# EAGLE design step_up_actuator (EAGLE 6.6.0)
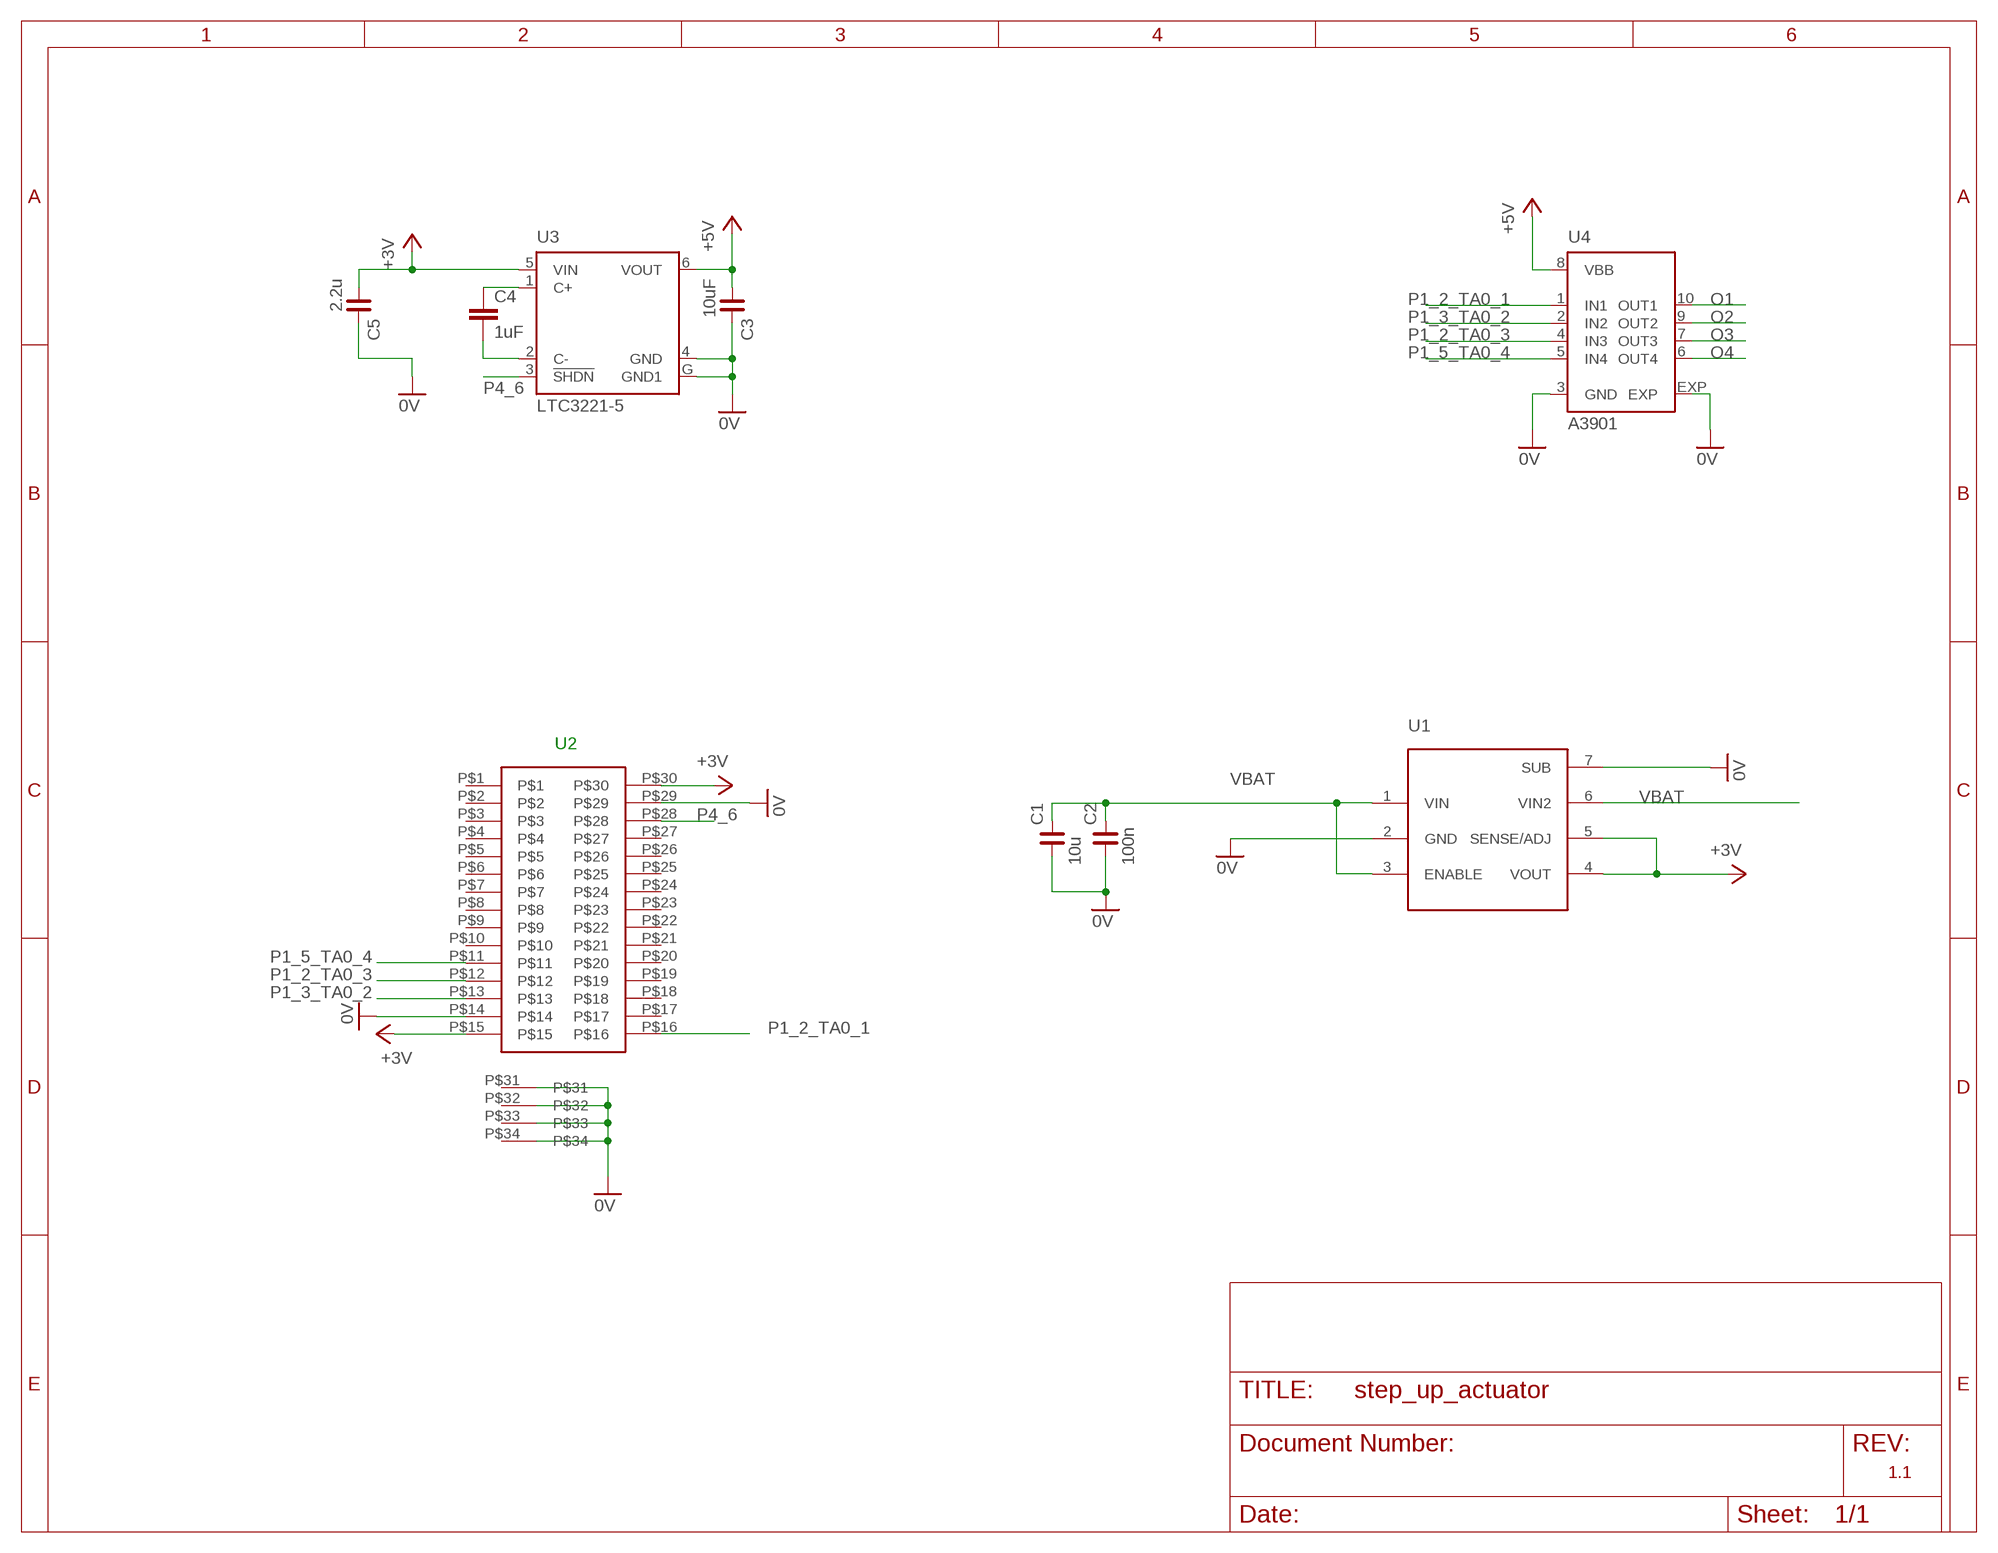
[diagram p0: schematic, sheet 1]

## Parts
C1  10u  C_0402  [C0402]
C2  100n  C_0402  [C0402]
C3  10uF  C_1206  [C1206]
C4  1uF  C-EUC0402  [C0402]
C5  2.2u  C_0402  [C0402]
U3  LTC3221-5  [DFN6-2X2]
U4  A3901  [DFN10-3X3]
U$1  NCP606  [NCP606]
U$3  51338-0374_RECEPTACLE  [51338-0374_RECEPTACLE]

## Nets
0V: C1.1 C2.1 C3.2 C5.2 U3.4(GND) U3.G(GND1) U4.3(GND) U4.EXP U$1.2(GND) U$1.7(SUB) U$3.P$14 U$3.P$29
+3V3: C5.1 U3.5(VIN) U$1.4(VOUT) U$1.5(SENSE/ADJ) U$3.P$15 U$3.P$30 ; supply symbol labelled +3V
+5V: C3.1 U3.6(VOUT) U4.8(VBB)
N$22: C4.1 U3.1(C+)
N$23: C4.2 U3.2(C-)
O1: U4.10(OUT1)
O2: U4.9(OUT2)
O3: U4.7(OUT3)
O4: U4.6(OUT4)
P1_2_TA0_1: U4.1(IN1) U$3.P$16
P1_2_TA0_3: U4.4(IN3) U$3.P$12
P1_3_TA0_2: U4.2(IN2) U$3.P$13
P1_5_TA0_4: U4.5(IN4) U$3.P$11
P4_6: U3.3(!SHDN) U$3.P$28
VBAT: C1.2 C2.2 U$1.1(VIN) U$1.3(ENABLE) U$1.6(VIN2)
Unconnected: U$3.P$1 U$3.P$2 U$3.P$3 U$3.P$4 U$3.P$5 U$3.P$6 U$3.P$7 U$3.P$8 U$3.P$9 U$3.P$10 U$3.P$17 U$3.P$18 U$3.P$19 U$3.P$20 U$3.P$21 U$3.P$22 U$3.P$23 U$3.P$24 U$3.P$25 U$3.P$26 U$3.P$27 U$3.P$31 U$3.P$32 U$3.P$33 U$3.P$34

## Notes on the sheet
- U1
- U2
- 1.1

## Library data of the parts
C1-C3 C5 = rc-master-smd:C_: NON-POLARIZED CAP
C4 = rcl:C-EU: CAPACITOR, European symbol
U3 = EKA:LTC3221-5
U4 = allegro:A3901: Dual Full Bridge Low Voltage Motor Driver Source: www.allegromicro.com .. 3901.pdf; MPN: A3901SEJTR-T; OC_FARNELL: 1651947; OC_NEWARK: 87K3379
U$1 = NCP606:NCP606
U$3 = Molex_SlimStack:51338-0374_RECEPTACLE

## Board
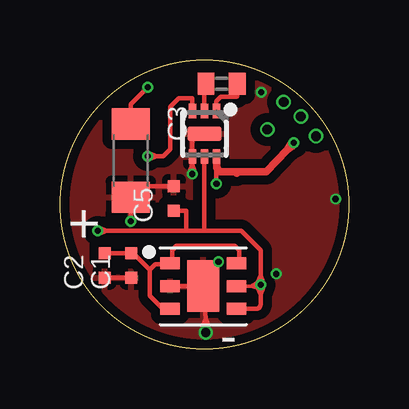
[diagram p1: board, top side]
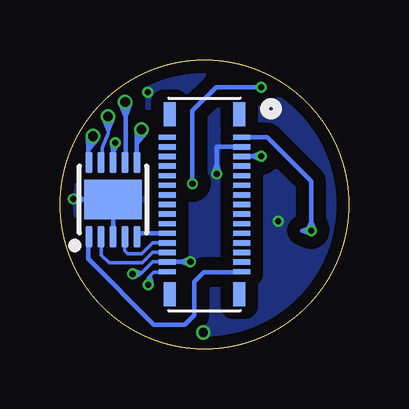
[diagram p2: board, bottom side, seen from below]

Size 12.04 x 12.04 mm. Coordinates in mm from the lower left corner, seen from the top.
Outline: circle at 6.02,6.02 radius 6.02
Copper layers (1+2*15+16): Top 0.0356mm / dielectric 0.1702mm / Route2 0.0178mm / dielectric 47mil / Route15 0.0178mm / dielectric 0.1702mm / Bottom 0.0356mm
Design rules "LaenPCBOrder - 4 layers *": minimum track width 5mil, minimum drill 10mil, track to track 5mil, track to pad 5mil, pad to pad 5mil, via to via 5mil, smd to smd 5mil, copper to edge 10mil, drill to drill 5mil, minimum pad ring 4mil, minimum via ring 4mil, stop-mask expansion 3mil, vias tented up to drill 10mil, thermal gap 10mil

### Footprints (pad centres in the part's own frame; a part is rotated, then mirrored left to right if it is on the bottom)
C0402 = smd 0.5 x 0.5: 1 -0.508,0; 2 0.508,0
C1206 = smd 1.3 x 1.6: 1 -1.524,0; 2 1.524,0
C0402' = smd 0.7 x 0.9: 1 -0.65,0; 2 0.65,0
DFN6-2X2 = smd 0.6 x 0.3: 1 -0.95,0.5; 2 -0.95,0; 3 -0.95,-0.5; 4 0.95,-0.5; 5 0.95,0; 6 0.95,0.5 | smd 0.61 x 1.42: G 0,0
DFN10-3X3 = smd 0.3 x 0.85: 1 -1,-1.55; 2 -0.5,-1.55; 3 0,-1.55; 4 0.5,-1.55; 5 1,-1.55; 6 1,1.55; 7 0.5,1.55; 8 0,1.55; 9 -0.5,1.55; 10 -1,1.55 | smd 2.38 x 1.65: EXP 0,0
NCP606 = smd 0.83 x 0.5: 1 -1.385,0.95; 2 -1.385,0; 3 -1.385,-0.95; 4 1.385,-0.95; 5 1.385,0; 6 1.385,0.95 | smd 1.35 x 2.15: 7 0,0
51338-0374_RECEPTACLE = smd 0.7 x 0.22: P$1 -1.55,2.8; P$2 -1.55,2.4; P$3 -1.55,2; P$4 -1.55,1.6; P$5 -1.55,1.2; P$6 -1.55,0.8; P$7 -1.55,0.4; P$8 -1.55,0; P$9 -1.55,-0.4; P$10 -1.55,-0.8; P$11 -1.55,-1.2; P$12 -1.55,-1.6; P$13 -1.55,-2; P$14 -1.55,-2.4; P$15 -1.55,-2.8; P$16 1.55,-2.8; P$17 1.55,-2.4; P$18 1.55,-2; P$19 1.55,-1.6; P$20 1.55,-1.2; P$21 1.55,-0.8; P$22 1.55,-0.4; P$23 1.55,0; P$24 1.55,0.4; P$25 1.55,0.8; P$26 1.55,1.2; P$27 1.55,1.6; P$28 1.55,2; P$29 1.55,2.4; P$30 1.55,2.8 | smd 0.5 x 1: P$31 1.45,3.75; P$32 -1.45,3.75; P$33 -1.45,-3.75; P$34 1.45,-3.75

### Placement (x,y rotation side)
C1  2.97,3.48 90 top
C2  1.85,3.48 90 top
C3  2.95,7.85 270 top
C4  1uF  [C0402']  6.73,11.05 180 top
C5  4.75,6.27 90 top
U3  6.02,8.97 270 top
U4  9.83,6.22 0 bottom
U$1  5.97,2.62 0 top
U$3  6.02,6.02 0 bottom

### Tracks (layer width: path | path; a pad name or v marks a point on that pad's centre or on a via)
0V  (via drill 0.25, 0.38)
  Top 0.178: U3.G 5.51,8.89 5.52,8.89 U3.4 5.51,7.67 | 5.51,7.67 v5.51,7.29 | 6.07,1.26 U$1.7 U$1.2 | 6.07,1.26 v6.07,0.69 | 5.51,7.67 5.38,7.34 | v5.51,7.29 5.38,7.34 | 5.51,7.67 5.64,7.34 | v5.51,7.29 5.64,7.34 | 5.51,7.67 5.38,7.34 | 5.51,7.67 5.64,7.34 | 5.51,7.67 5.38,7.34 | v5.51,7.29 5.38,7.34 | 5.51,7.67 5.64,7.34 | v5.51,7.29 5.64,7.34 | 6.07,1.26 5.88,0.76 | v6.07,0.69 5.88,0.76 | 6.07,1.26 6.26,0.76 | v6.07,0.69 6.26,0.76 | 6.07,1.26 5.88,0.76 | 5.88,0.76 | 6.07,1.26 6.26,0.76 | v6.07,0.69 6.26,0.76 | 6.07,1.26 5.88,0.76 | v6.07,0.69 5.88,0.76 | 6.07,1.26 6.26,0.76 | v6.07,0.69 6.26,0.76 | C5.2 2.95,6.78 C3.2 | C2.1 C1.1 | v2.95,5.33 C3.2 2.94,6.34 2.94,6.33 2.93,6.33 2.93,6.34
  Bottom 0.14: 7.58,3.63 8.18,3.63 8.64,3.17 | 8.64,3.17 8.69,3.12 v9.02,3.12 | 8.64,3.17 8.93,2.99 | v9.02,3.12 8.93,2.99 | 8.64,3.17 8.97,3.28 | v9.02,3.12 8.97,3.28 | 8.64,3.17 8.93,2.99 | v9.02,3.12 8.93,2.99 | 8.64,3.17 8.97,3.28 | v9.02,3.12 8.97,3.28
  Bottom 0.178: v5.51,7.29 5.51,7.67 | 5.51,7.67 5.51,8.42 U$3.P$29 | 7.58,3.63 U$3.P$14 7.56,3.63 6.98,3.63 | v11.48,6.25 U4.EXP U4.3 | v6.6,3.63 6.98,3.63 | 5.51,7.67 5.38,7.34 | v5.51,7.29 5.38,7.34 | 5.51,7.67 5.64,7.34 | v5.51,7.29 5.64,7.34 | 5.51,7.67 5.38,7.34 | 5.51,7.67 5.64,7.34 | 5.51,7.67 5.38,7.34 | v5.51,7.29 5.38,7.34 | 5.51,7.67 5.64,7.34 | v5.51,7.29 5.64,7.34 | v11.48,6.25 11.43,6.12 11.1,6.24 11.43,6.38 v11.48,6.25 | 6.98,3.63 6.65,3.76 v6.6,3.63 | 6.98,3.63 6.65,3.5 v6.6,3.63
  other vias: 8.38,10.69
  pour Bottom (isolate 0.533): 0.03,6.05 arc-90 6.07,12.04 arc-90 12.04,6.07 arc-89 6.1,0 arc-92
  pour Top (isolate 0.381): 0.03,6.05 arc-90 6.07,12.04 arc-90 12.04,6.07 arc-89 6.1,0 arc-92 0.03,6.02
+3V3  (via drill 0.25)
  Top 0.14: v8.36,2.67 8.31,2.62 7.98,2.62 | 7.98,2.62 U$1.5 | 7.98,2.62 8.31,2.51 v8.36,2.67 | 7.98,2.62 8.27,2.8 v8.36,2.67
  Top 0.178: U$1.4 7.46,1.68 8.18,1.68 arc90 8.36,1.85 8.36,2.29 | 8.36,2.29 v8.36,2.67 | 8.36,3.05 8.36,4.11 7.54,4.93 5.94,4.93 | 8.36,3.05 v8.36,2.67 | v1.57,4.93 1.96,4.93 | 1.96,4.93 5.26,4.93 | 5.26,4.93 5.94,4.93 | U3.5 6.02,5 5.94,4.93 | 8.36,2.29 8.49,2.62 | v8.36,2.67 8.49,2.62 | 8.36,2.29 8.23,2.62 | v8.36,2.67 8.23,2.62 | 8.36,3.05 8.23,2.72 | v8.36,2.67 8.23,2.72 | 8.36,3.05 8.49,2.72 | v8.36,2.67 8.49,2.72 | 8.36,2.29 8.49,2.62 | 8.36,2.29 8.23,2.62 | 8.36,2.29 8.49,2.62 | v8.36,2.67 8.49,2.62 | 8.36,2.29 8.23,2.62 | v8.36,2.67 8.23,2.62 | 8.36,3.05 8.23,2.72 | 8.36,3.05 8.49,2.72 | 8.36,3.05 8.23,2.72 | v8.36,2.67 8.23,2.72 | 8.36,3.05 8.49,2.72 | v8.36,2.67 8.49,2.72 | 1.96,4.93 1.63,5.06 | v1.57,4.93 1.63,5.06 | 1.96,4.93 1.63,4.8 | v1.57,4.93 1.63,4.8 | 1.96,4.93 1.63,5.06 | 1.96,4.93 1.63,4.8 | 1.96,4.93 1.63,5.06 | v1.57,4.93 1.63,5.06 | 1.96,4.93 1.63,4.8 | v1.57,4.93 1.63,4.8 | C5.1 5.26,5.77 5.26,4.93
  Bottom 0.14: 7.59,3.2 8.13,3.2 8.29,3.04 | 8.29,3.04 8.36,2.97 v8.36,2.67 | 8.29,3.04 8.2,2.71 v8.36,2.67 | 8.29,3.04 8.49,2.76 v8.36,2.67
  Bottom 0.178: U$3.P$30 3.41,8.82 1.57,6.98 1.57,5.31 | U$3.P$15 7.59,3.2 | 1.96,4.93 v1.57,4.93 | v1.57,4.93 1.57,5.31 | 1.96,4.93 1.63,5.06 | v1.57,4.93 1.63,5.06 | 1.96,4.93 1.63,4.8 | v1.57,4.93 1.63,4.8 | 1.57,5.31 1.44,4.98 | v1.57,4.93 1.44,4.98 | 1.57,5.31 1.7,4.98 | v1.57,4.93 1.7,4.98 | 1.96,4.93 1.63,5.06 | 1.96,4.93 1.63,4.8 | 1.96,4.93 1.63,5.06 | v1.57,4.93 1.63,5.06 | 1.96,4.93 1.63,4.8 | v1.57,4.93 1.63,4.8 | 1.57,5.31 1.44,4.98 | 1.57,5.31 1.7,4.98 | 1.57,5.31 1.44,4.98 | v1.57,4.93 1.44,4.98 | 1.57,5.31 1.7,4.98 | v1.57,4.93 1.7,4.98
+5V  (via drill 0.25)
  Top 0.178: 6.5,8 U3.6 v6.52,6.89 | C3.1 2.95,10.2 v3.65,10.9
  Top 0.305: U3.6 6.53,7.54 6.68,7.39 7.29,7.39 7.37,7.31 7.37,7.39 8.6,7.39 9.48,8.31 | v9.74,8.58 9.48,8.31 | 9.48,8.31 9.78,8.52 | v9.74,8.58 9.78,8.52 | 9.48,8.31 9.78,8.52 | v9.74,8.58 9.78,8.52 | 9.48,8.31 9.68,8.63 v9.74,8.58
  Bottom 0.178: U4.8 9.83,8.21 | 9.83,8.21 9.83,8.58 v9.74,8.58 | 9.83,8.21 9.88,8.57 v9.74,8.58 | 9.83,8.21 9.63,8.5 v9.74,8.58 | v3.65,10.9 5.54,10.9 6.52,9.92 v6.52,6.89
N$22
  Top 0.178: U3.1 6.52,10.33 6.71,10.52 7.37,10.52 7.38,10.53 C4.1 7.39,11.04
N$23
  Top 0.178: U3.2 6.04,9.94 6.02,9.94 6.02,11.05 C4.2
O1  (via drill 0.4)
  Bottom 0.178: U4.10 10.87,7.81 10.87,8.3 | 10.87,8.3 10.87,8.58 v10.67,8.86 | 10.87,8.3 10.88,8.86 v10.67,8.86 | 10.87,8.3 10.51,8.73 v10.67,8.86
O2  (via drill 0.4)
  Bottom 0.14: 10.29,7.82 10.29,8.38 10.03,8.99 10.03,9.08 | 10.03,9.08 v10.03,9.68 | 10.03,9.08 10.25,9.59 | v10.03,9.68 10.25,9.59 | 10.03,9.08 9.82,9.59 | v10.03,9.68 9.82,9.59 | 10.03,9.08 10.25,9.59 | 10.03,9.08 9.82,9.59 | 10.03,9.08 10.25,9.59 | v10.03,9.68 10.25,9.59 | 10.03,9.08 9.82,9.59 | v10.03,9.68 9.82,9.59
  Bottom 0.178: U4.9 10.29,7.82
O3  (via drill 0.4)
  Bottom 0.178: U4.7 9.3,7.81 9.32,7.83 9.3,7.83 9.3,9.69 | 9.3,9.69 9.3,10.29 v9.32,10.29 | 9.3,9.69 9.52,10.2 v9.32,10.29 | 9.3,9.69 9.12,10.22 v9.32,10.29
O4  (via drill 0.4)
  Bottom 0.178: U4.6 8.84,7.78 8.84,8.58 | 8.84,8.58 8.84,8.94 v8.64,9.14 | 8.84,8.58 8.85,9.14 v8.64,9.14 | 8.84,8.58 8.47,9.01 v8.64,9.14
P1_2_TA0_1
  Bottom 0.178: U$3.P$16 4.5,3.2 6.04,3.2 6.45,2.79 6.45,1.4 6.83,1.02 8.13,1.02 10.87,3.76 10.87,4.63 U4.1
P1_2_TA0_3
  Bottom 0.14: U$3.P$12 8.18,4.42 8.64,3.96 9.22,3.96 9.35,4.09 9.35,4.66
  Bottom 0.178: 9.35,4.66 U4.4
P1_3_TA0_2
  Bottom 0.14: U$3.P$13 8.17,4.02 8.61,3.58 9.98,3.58 10.31,3.91 10.31,4.66
  Bottom 0.178: 10.31,4.66 U4.2
P1_5_TA0_4
  Bottom 0.178: U$3.P$11 8.68,4.82 U4.5
P4_6  (via drill 0.25)
  Top 0.178: v3.66,8.03 4.04,8.03 | 4.04,8.03 4.29,8.03 4.6,8.33 4.6,10.08 4.95,10.44 5.52,10.44 U3.3 | 4.04,8.03 3.71,8.16 | v3.66,8.03 3.71,8.16 | 4.04,8.03 3.71,7.9 | v3.66,8.03 3.71,7.9 | 4.04,8.03 3.71,8.16 | 4.04,8.03 3.71,7.9 | 4.04,8.03 3.71,8.16 | v3.66,8.03 3.71,8.16 | 4.04,8.03 3.71,7.9 | v3.66,8.03 3.71,7.9
  Bottom 0.178: v3.66,8.03 4.04,8.03 | 4.04,8.03 U$3.P$28 | 4.04,8.03 3.71,8.16 | v3.66,8.03 3.71,8.16 | 4.04,8.03 3.71,7.9 | v3.66,8.03 3.71,7.9 | 4.04,8.03 3.71,8.16 | 4.04,8.03 3.71,7.9 | 4.04,8.03 3.71,8.16 | v3.66,8.03 3.71,8.16 | 4.04,8.03 3.71,7.9 | v3.66,8.03 3.71,7.9
VBAT
  Top 0.178: U$1.3 4.28,1.67 3.73,2.21 3.73,3.3 | U$1.6 7.47,3.58 7.47,4.11 7.29,4.29 4.85,4.29 4.67,4.11 4.67,3.58 U$1.1 4.65,3.53 3.96,3.53 3.73,3.3 | C2.2 C1.2 3.05,3.99 3.73,3.3

### Text on the board
tPlace: + | -